# EAGLE schematic test (EAGLE 7.4.0)
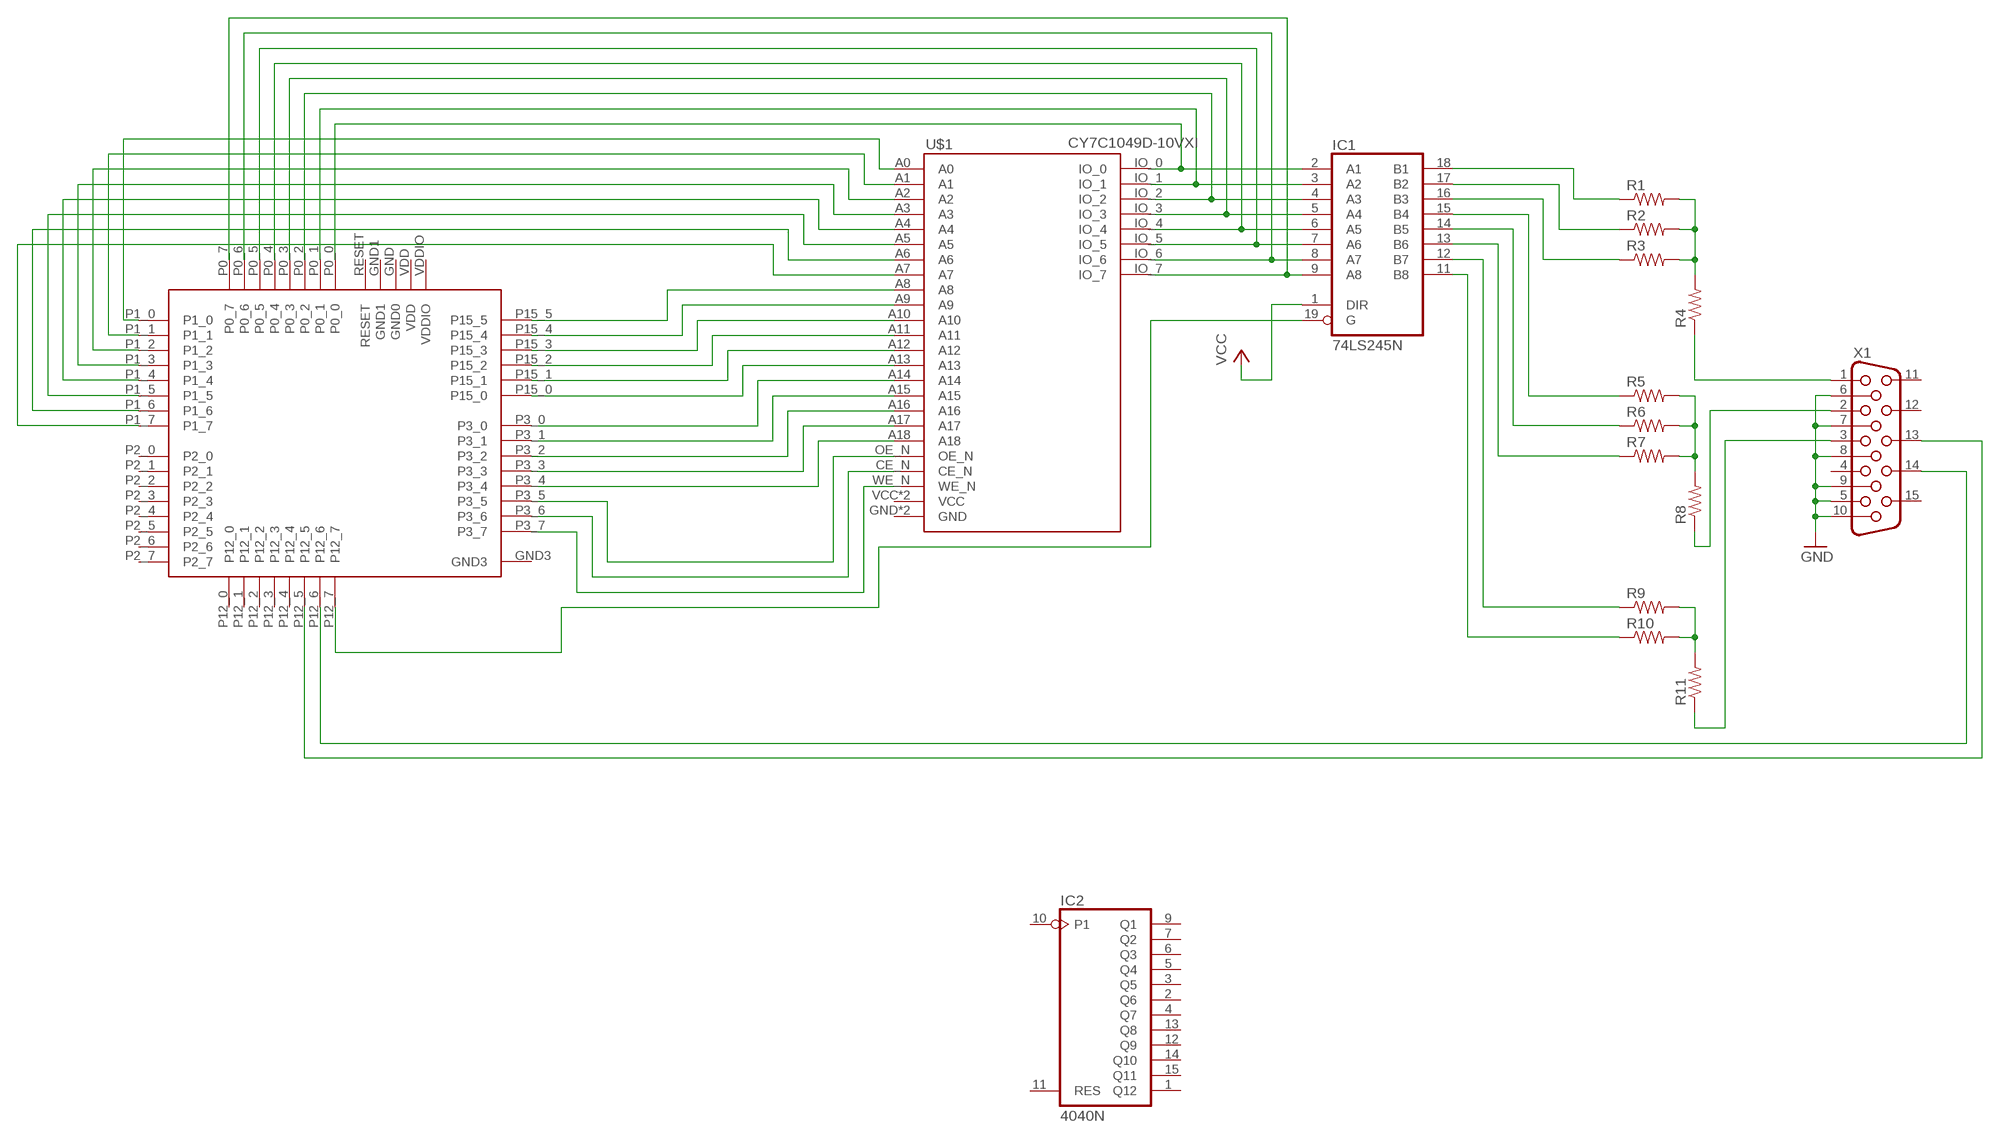
[diagram p0: schematic, sheet 1]

## Parts
IC1  74LS245N  [DIL20]
IC2  4040N  [DIL16]
R1  R-US_0207/10  [0207/10]
R2  R-US_0207/10  [0207/10]
R3  R-US_0207/10  [0207/10]
R4  R-US_0207/10  [0207/10]
R5  R-US_0207/10  [0207/10]
R6  R-US_0207/10  [0207/10]
R7  R-US_0207/10  [0207/10]
R8  R-US_0207/10  [0207/10]
R9  R-US_0207/10  [0207/10]
R10  R-US_0207/10  [0207/10]
R11  R-US_0207/10  [0207/10]
U$1  CY7C1049D-10VXI  [SOJ36]
U$2  CY8CKIT-059  [PSOC_STICK]
X1  HF15H  [HDF15H]

## Nets
GND: X1.5 X1.6 X1.7 X1.8 X1.9 X1.10
IO0: IC1.2(A1) U$1.IO_0 U$2.P0_0
IO1: IC1.3(A2) U$1.IO_1 U$2.P0_1
IO2: IC1.4(A3) U$1.IO_2 U$2.P0_2
IO3: IC1.5(A4) U$1.IO_3 U$2.P0_3
IO4: IC1.6(A5) U$1.IO_4 U$2.P0_4
IO5: IC1.7(A6) U$1.IO_5 U$2.P0_5
IO6: IC1.8(A7) U$1.IO_6 U$2.P0_6
IO7: IC1.9(A8) U$1.IO_7 U$2.P0_7
N$1: R1.2 R2.2 R3.2 R4.2
N$2: R5.2 R6.2 R7.2 R8.2
N$3: R9.2 R10.2 R11.2
N$4: R4.1 X1.1
N$5: R8.1 X1.2
N$6: R11.1 X1.3
N$7: IC1.18(B1) R1.1
N$8: IC1.17(B2) R2.1
N$9: IC1.16(B3) R3.1
N$10: IC1.15(B4) R5.1
N$11: IC1.14(B5) R6.1
N$12: IC1.13(B6) R7.1
N$13: IC1.12(B7) R9.1
N$14: IC1.11(B8) R10.1
N$15: U$1.CE_N U$2.P3_6
N$16: U$2.P12_5 X1.13
N$17: U$2.P12_6 X1.14
N$18: U$1.WE_N U$2.P3_7
N$19: IC1.19(G) U$2.P12_7
N$20: U$1.A0 U$2.P1_0
N$21: U$1.A1 U$2.P1_1
N$22: U$1.A2 U$2.P1_2
N$23: U$1.A3 U$2.P1_3
N$24: U$1.A4 U$2.P1_4
N$25: U$1.OE_N U$2.P3_5
N$26: U$1.A5 U$2.P1_5
N$27: U$1.A6 U$2.P1_6
N$28: U$1.A7 U$2.P1_7
N$29: U$1.A18 U$2.P3_4
N$30: U$1.A17 U$2.P3_3
N$31: U$1.A16 U$2.P3_2
N$32: U$1.A15 U$2.P3_1
N$33: U$1.A14 U$2.P3_0
N$34: U$1.A13 U$2.P15_0
N$35: U$1.A12 U$2.P15_1
N$36: U$1.A11 U$2.P15_2
N$37: U$1.A10 U$2.P15_3
N$38: U$1.A9 U$2.P15_4
N$39: U$1.A8 U$2.P15_5
VCC: IC1.1(DIR)
Unconnected: IC2.1(Q12) IC2.2(Q6) IC2.3(Q5) IC2.4(Q7) IC2.5(Q4) IC2.6(Q3) IC2.7(Q2) IC2.9(Q1) IC2.10(P1) IC2.11(RES) IC2.12(Q9) IC2.13(Q8) IC2.14(Q10) IC2.15(Q11) U$2.GND3 U$2.P2_0 U$2.P2_1 U$2.P2_2 U$2.P2_3 U$2.P2_4 U$2.P2_5 U$2.P2_6 U$2.P2_7 U$2.P12_0 U$2.P12_1 U$2.P12_2 U$2.P12_3 U$2.P12_4 U$2.RESET X1.4 X1.11 X1.12 X1.15

## Power pins joined to a net without a drawn wire
GND: IC1.10(GND) U$1.GND U$1.GND_(GND)
GND0: U$2.GND(GND0)
GND1: U$2.GND1
VCC: IC1.20(VCC) U$1.VCC U$1.VCC_(VCC)
VDD: IC2.16(VDD) U$2.VDD
VDDIO: U$2.VDDIO
VSS: IC2.8(VSS)

## Library data of the parts
IC1 = 74xx-us:74*245: Octal BUS TRANSCEIVER, 3-state
IC2 = 40xx:4040: 12-stage binary/ripple COUNTER
R1-R11 = resistor:R-US_: RESISTOR, American symbol
U$1 = CY8C5888LTI-LP097:CY7C1049D-10VXI
U$2 = CY8C5888LTI-LP097:CY8CKIT-059
X1 = con-subd:HF15: SUB-D; OC_FARNELL: unknown; OC_NEWARK: unknown